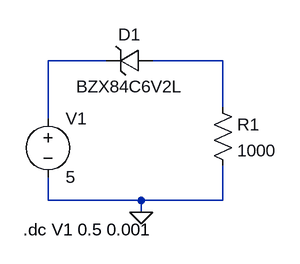
[diagram p0: schematic ZENER DIODE REVERSE BIAS.asc]
ZENER DIODE REVERSE BIAS.asc, the LTspice schematic file:
Version 4
SHEET 1 880 680
WIRE 160 64 80 64
WIRE 320 64 224 64
WIRE 320 128 320 64
WIRE 80 144 80 64
WIRE 80 256 80 224
WIRE 208 256 80 256
WIRE 320 256 320 208
WIRE 320 256 208 256
WIRE 208 272 208 256
FLAG 208 272 0
SYMBOL zener 224 48 R90
WINDOW 0 -4 32 VBottom 2
WINDOW 3 36 32 VTop 2
SYMATTR InstName D1
SYMATTR Value BZX84C6V2L
SYMBOL res 304 112 R0
SYMATTR InstName R1
SYMATTR Value 1000
SYMBOL voltage 80 128 R0
WINDOW 123 0 0 Left 0
WINDOW 39 0 0 Left 0
SYMATTR InstName V1
SYMATTR Value 5
TEXT 46 296 Left 2 !.dc V1 0.5 0.001

The netlist it stands for:
* ZENER DIODE REVERSE BIAS.asc
D1 N002 N001 BZX84C6V2L
R1 N002 0 1000
V1 N001 0 5
.model D D
.lib standard.dio
.dc V1 0.5 0.001
.backanno
.end